# EAGLE schematic bottomtesting v6 (EAGLE 9.7.0)
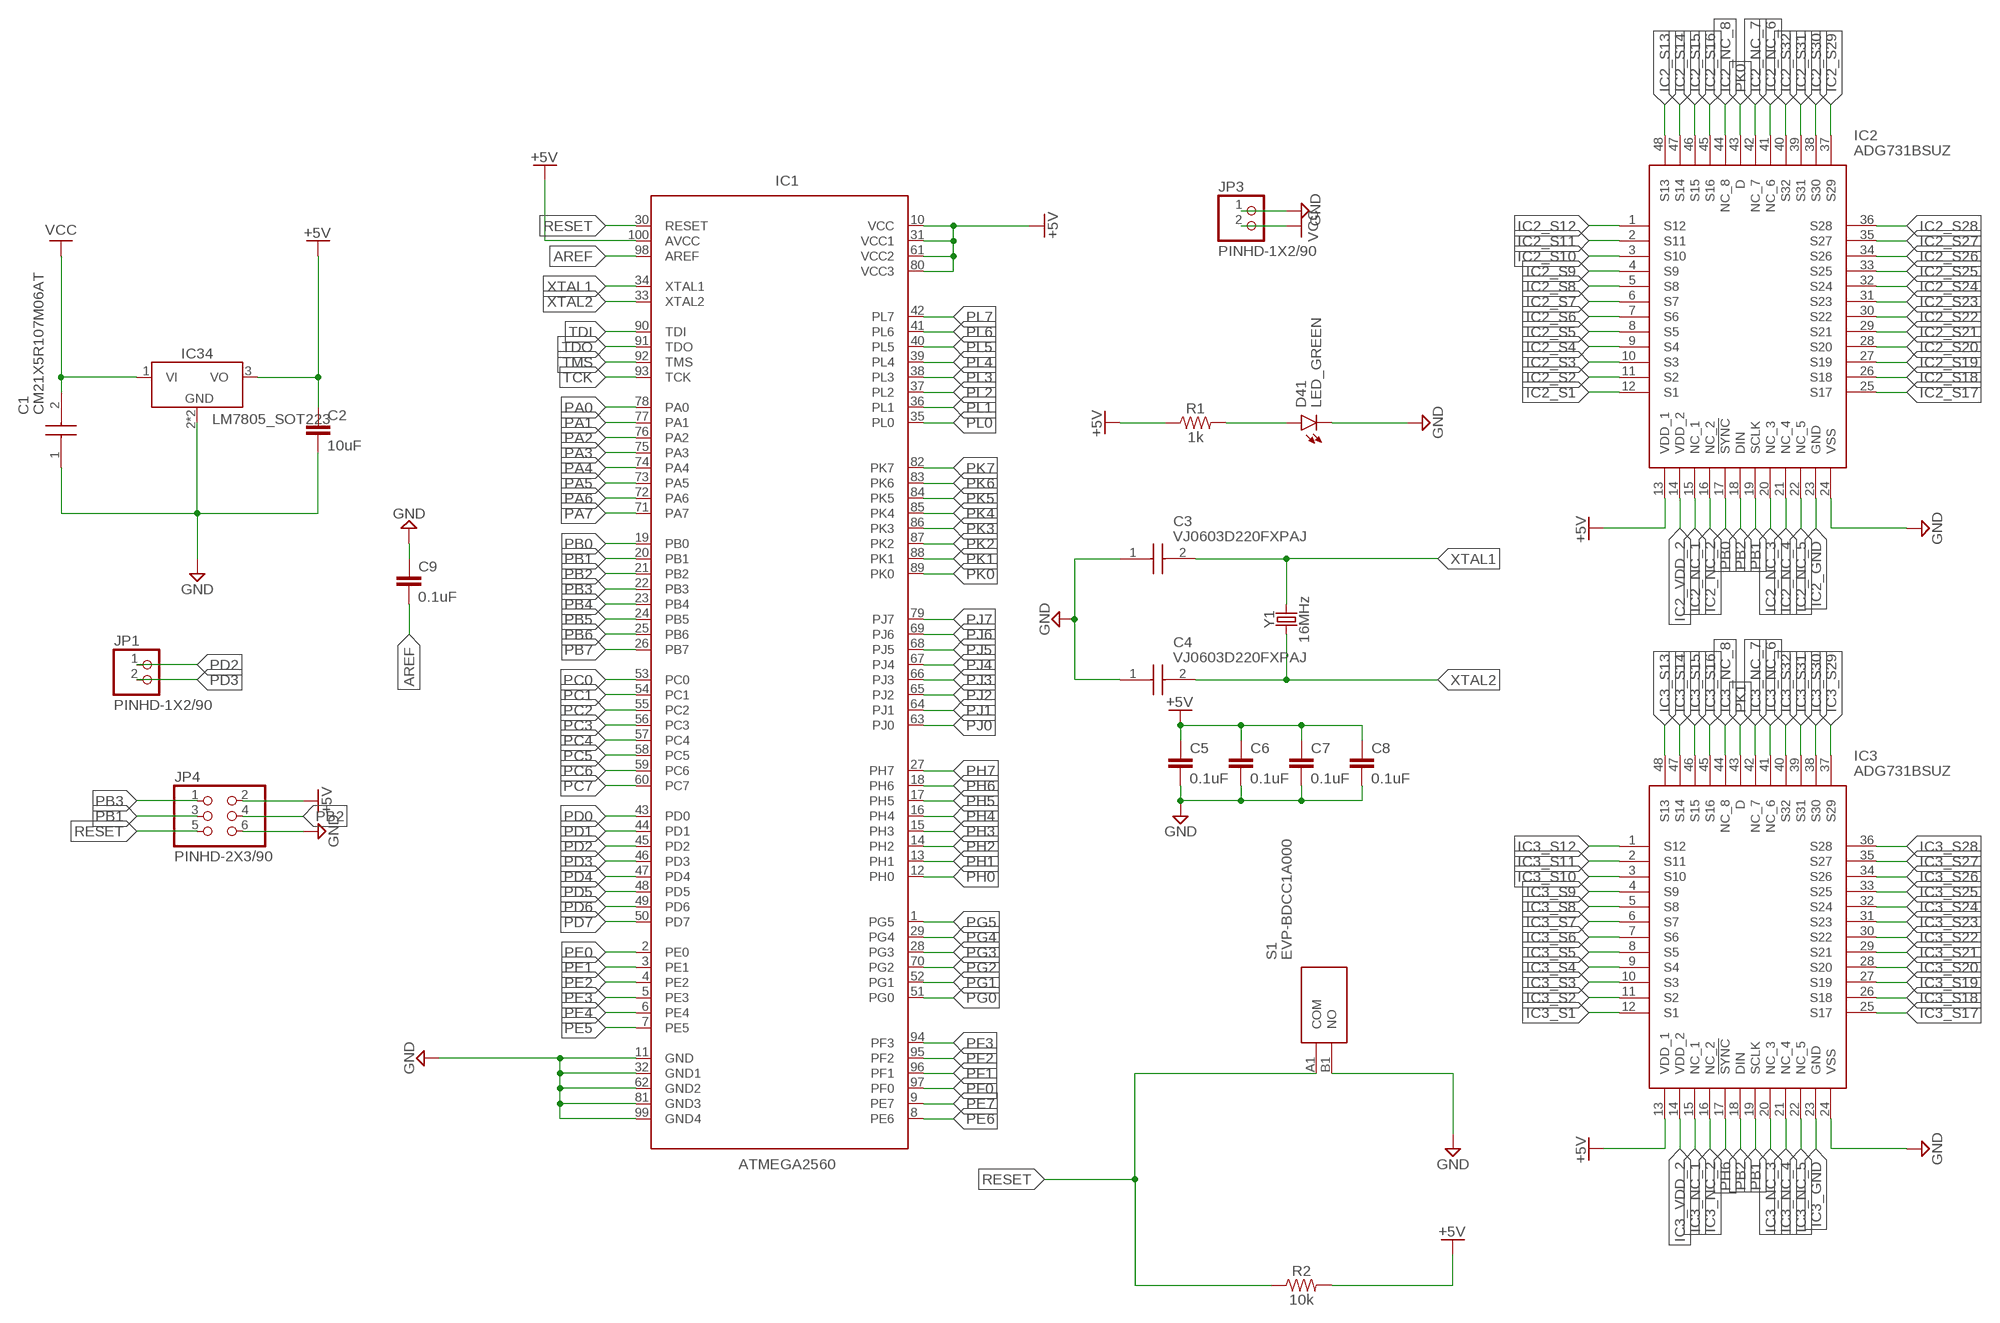
[diagram p0: schematic, sheet 1, part 1 of 2]
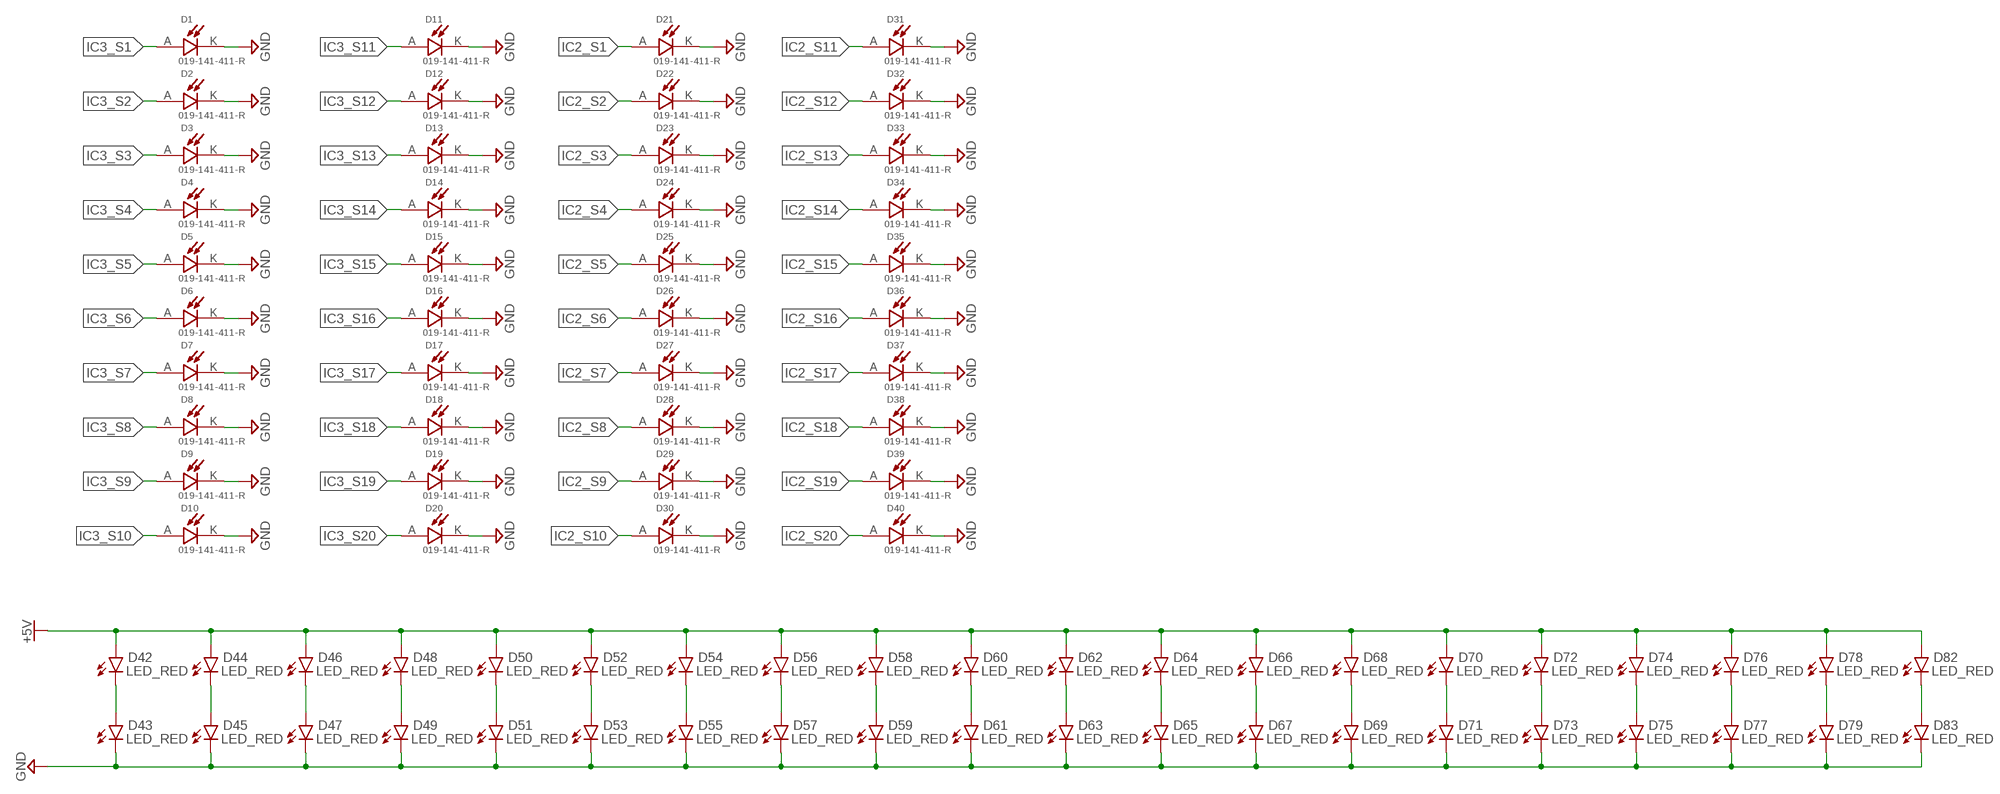
[diagram p1: schematic, sheet 1, part 2 of 2]

## Parts
C1  CM21X5R107M06AT  [CAPC2012X135N]
C2  10uF  10UF-0805-25V-10%  [0805]
C3  VJ0603D220FXPAJ  [CAPC1608X94N]
C4  VJ0603D220FXPAJ  [CAPC1608X94N]
C5  0.1uF  0.1UF-0402T-16V-10%  [0402-TIGHT]
C6  0.1uF  0.1UF-0402T-16V-10%  [0402-TIGHT]
C7  0.1uF  0.1UF-0402T-16V-10%  [0402-TIGHT]
C8  0.1uF  0.1UF-0402T-16V-10%  [0402-TIGHT]
C9  0.1uF  0.1UF-0402T-16V-10%  [0402-TIGHT]
D1  019-141-411-R  [DIOC2012X80N]
D2  019-141-411-R  [DIOC2012X80N]
D3  019-141-411-R  [DIOC2012X80N]
D4  019-141-411-R  [DIOC2012X80N]
D5  019-141-411-R  [DIOC2012X80N]
D6  019-141-411-R  [DIOC2012X80N]
D7  019-141-411-R  [DIOC2012X80N]
D8  019-141-411-R  [DIOC2012X80N]
D9  019-141-411-R  [DIOC2012X80N]
D10  019-141-411-R  [DIOC2012X80N]
D11  019-141-411-R  [DIOC2012X80N]
D12  019-141-411-R  [DIOC2012X80N]
D13  019-141-411-R  [DIOC2012X80N]
D14  019-141-411-R  [DIOC2012X80N]
D15  019-141-411-R  [DIOC2012X80N]
D16  019-141-411-R  [DIOC2012X80N]
D17  019-141-411-R  [DIOC2012X80N]
D18  019-141-411-R  [DIOC2012X80N]
D19  019-141-411-R  [DIOC2012X80N]
D20  019-141-411-R  [DIOC2012X80N]
D21  019-141-411-R  [DIOC2012X80N]
D22  019-141-411-R  [DIOC2012X80N]
D23  019-141-411-R  [DIOC2012X80N]
D24  019-141-411-R  [DIOC2012X80N]
D25  019-141-411-R  [DIOC2012X80N]
D26  019-141-411-R  [DIOC2012X80N]
D27  019-141-411-R  [DIOC2012X80N]
D28  019-141-411-R  [DIOC2012X80N]
D29  019-141-411-R  [DIOC2012X80N]
D30  019-141-411-R  [DIOC2012X80N]
D31  019-141-411-R  [DIOC2012X80N]
D32  019-141-411-R  [DIOC2012X80N]
D33  019-141-411-R  [DIOC2012X80N]
D34  019-141-411-R  [DIOC2012X80N]
D35  019-141-411-R  [DIOC2012X80N]
D36  019-141-411-R  [DIOC2012X80N]
D37  019-141-411-R  [DIOC2012X80N]
D38  019-141-411-R  [DIOC2012X80N]
D39  019-141-411-R  [DIOC2012X80N]
D40  019-141-411-R  [DIOC2012X80N]
D41  LED_GREEN  CHIP-FLAT-G_0402  [LEDC1005X25N_FLAT-G]
D42  LED_RED  LED_CHIPRED-3216  [LEDC3216X110N_R]
D43  LED_RED  LED_CHIPRED-3216  [LEDC3216X110N_R]
D44  LED_RED  LED_CHIPRED-3216  [LEDC3216X110N_R]
D45  LED_RED  LED_CHIPRED-3216  [LEDC3216X110N_R]
D46  LED_RED  LED_CHIPRED-3216  [LEDC3216X110N_R]
D47  LED_RED  LED_CHIPRED-3216  [LEDC3216X110N_R]
D48  LED_RED  LED_CHIPRED-3216  [LEDC3216X110N_R]
D49  LED_RED  LED_CHIPRED-3216  [LEDC3216X110N_R]
D50  LED_RED  LED_CHIPRED-3216  [LEDC3216X110N_R]
D51  LED_RED  LED_CHIPRED-3216  [LEDC3216X110N_R]
D52  LED_RED  LED_CHIPRED-3216  [LEDC3216X110N_R]
D53  LED_RED  LED_CHIPRED-3216  [LEDC3216X110N_R]
D54  LED_RED  LED_CHIPRED-3216  [LEDC3216X110N_R]
D55  LED_RED  LED_CHIPRED-3216  [LEDC3216X110N_R]
D56  LED_RED  LED_CHIPRED-3216  [LEDC3216X110N_R]
D57  LED_RED  LED_CHIPRED-3216  [LEDC3216X110N_R]
D58  LED_RED  LED_CHIPRED-3216  [LEDC3216X110N_R]
D59  LED_RED  LED_CHIPRED-3216  [LEDC3216X110N_R]
D60  LED_RED  LED_CHIPRED-3216  [LEDC3216X110N_R]
D61  LED_RED  LED_CHIPRED-3216  [LEDC3216X110N_R]
D62  LED_RED  LED_CHIPRED-3216  [LEDC3216X110N_R]
D63  LED_RED  LED_CHIPRED-3216  [LEDC3216X110N_R]
D64  LED_RED  LED_CHIPRED-3216  [LEDC3216X110N_R]
D65  LED_RED  LED_CHIPRED-3216  [LEDC3216X110N_R]
D66  LED_RED  LED_CHIPRED-3216  [LEDC3216X110N_R]
D67  LED_RED  LED_CHIPRED-3216  [LEDC3216X110N_R]
D68  LED_RED  LED_CHIPRED-3216  [LEDC3216X110N_R]
D69  LED_RED  LED_CHIPRED-3216  [LEDC3216X110N_R]
D70  LED_RED  LED_CHIPRED-3216  [LEDC3216X110N_R]
D71  LED_RED  LED_CHIPRED-3216  [LEDC3216X110N_R]
D72  LED_RED  LED_CHIPRED-3216  [LEDC3216X110N_R]
D73  LED_RED  LED_CHIPRED-3216  [LEDC3216X110N_R]
D74  LED_RED  LED_CHIPRED-3216  [LEDC3216X110N_R]
D75  LED_RED  LED_CHIPRED-3216  [LEDC3216X110N_R]
D76  LED_RED  LED_CHIPRED-3216  [LEDC3216X110N_R]
D77  LED_RED  LED_CHIPRED-3216  [LEDC3216X110N_R]
D78  LED_RED  LED_CHIPRED-3216  [LEDC3216X110N_R]
D79  LED_RED  LED_CHIPRED-3216  [LEDC3216X110N_R]
D82  LED_RED  LED_CHIPRED-3216  [LEDC3216X110N_R]
D83  LED_RED  LED_CHIPRED-3216  [LEDC3216X110N_R]
IC1  ATMEGA2560  ATMEGA2560-16AUR_QFP  [QFP50P1600X1600X160-100N]
IC2  ADG731BSUZ  [QFP50P900X900X120-48N]
IC3  ADG731BSUZ  [QFP50P900X900X120-48N]
IC34  LM7805_SOT223  [SOT230P700X170-4]
JP1  PINHD-1X2/90  [1X02/90]
JP3  PINHD-1X2/90  [1X02/90]
JP4  PINHD-2X3/90  [2X03/90]
R1  1k  1KOHM-0603-1/10W-1%  [0603]
R2  10k  10KOHM-0603-1/10W-1%  [0603]
S1  EVP-BDCC1A000  [EVPBDCC1A000]
Y1  16MHz  CRYSTAL-16MHZPTH-HC49US  [HC49US]

## Nets
+5V: C2.1 C5.1 C6.1 C7.1 C8.1 D42.2(A) D44.2(A) D46.2(A) D48.2(A) D50.2(A) D52.2(A) D54.2(A) D56.2(A) D58.2(A) D60.2(A) D62.2(A) D64.2(A) D66.2(A) D68.2(A) D70.2(A) D72.2(A) D74.2(A) D76.2(A) D78.2(A) D82.2(A) IC1.10(VCC) IC1.31(VCC1) IC1.61(VCC2) IC1.80(VCC3) IC1.100(AVCC) IC2.13(VDD_1) IC3.13(VDD_1) IC34.3(VO) JP4.2 R1.1 R2.2
AREF: C9.2 IC1.98(AREF)
GND: C1.1 C2.2 C5.2 C6.2 C7.2 C8.2 C9.1 D1.K(C) D2.K(C) D3.K(C) D4.K(C) D5.K(C) D6.K(C) D7.K(C) D8.K(C) D9.K(C) D10.K(C) D11.K(C) D12.K(C) D13.K(C) D14.K(C) D15.K(C) D16.K(C) D17.K(C) D18.K(C) D19.K(C) D20.K(C) D21.K(C) D22.K(C) D23.K(C) D24.K(C) D25.K(C) D26.K(C) D27.K(C) D28.K(C) D29.K(C) D30.K(C) D31.K(C) D32.K(C) D33.K(C) D34.K(C) D35.K(C) D36.K(C) D37.K(C) D38.K(C) D39.K(C) D40.K(C) D41.C D43.1(C) D45.1(C) D47.1(C) D49.1(C) D51.1(C) D53.1(C) D55.1(C) D57.1(C) D59.1(C) D61.1(C) D63.1(C) D65.1(C) D67.1(C) D69.1(C) D71.1(C) D73.1(C) D75.1(C) D77.1(C) D79.1(C) D83.1(C) IC1.11(GND) IC1.32(GND1) IC1.62(GND2) IC1.81(GND3) IC1.99(GND4) IC2.24(VSS) IC3.24(VSS) IC34.2(GND) IC34.4(GND) JP3.1 JP4.6 S1.B1(NO)
IC2_GND: IC2.23(GND)
IC2_NC_1: IC2.15(NC_1)
IC2_NC_2: IC2.16(NC_2)
IC2_NC_3: IC2.20(NC_3)
IC2_NC_4: IC2.21(NC_4)
IC2_NC_5: IC2.22(NC_5)
IC2_NC_6: IC2.41(NC_6)
IC2_NC_7: IC2.42(NC_7)
IC2_NC_8: IC2.44(NC_8)
IC2_S1: D21.A IC2.12(S1)
IC2_S2: D22.A IC2.11(S2)
IC2_S3: D23.A IC2.10(S3)
IC2_S4: D24.A IC2.9(S4)
IC2_S5: D25.A IC2.8(S5)
IC2_S6: D26.A IC2.7(S6)
IC2_S7: D27.A IC2.6(S7)
IC2_S8: D28.A IC2.5(S8)
IC2_S9: D29.A IC2.4(S9)
IC2_S10: D30.A IC2.3(S10)
IC2_S11: D31.A IC2.2(S11)
IC2_S12: D32.A IC2.1(S12)
IC2_S13: D33.A IC2.48(S13)
IC2_S14: D34.A IC2.47(S14)
IC2_S15: D35.A IC2.46(S15)
IC2_S16: D36.A IC2.45(S16)
IC2_S17: D37.A IC2.25(S17)
IC2_S18: D38.A IC2.26(S18)
IC2_S19: D39.A IC2.27(S19)
IC2_S20: D40.A IC2.28(S20)
IC2_S21: IC2.29(S21)
IC2_S22: IC2.30(S22)
IC2_S23: IC2.31(S23)
IC2_S24: IC2.32(S24)
IC2_S25: IC2.33(S25)
IC2_S26: IC2.34(S26)
IC2_S27: IC2.35(S27)
IC2_S28: IC2.36(S28)
IC2_S29: IC2.37(S29)
IC2_S30: IC2.38(S30)
IC2_S31: IC2.39(S31)
IC2_S32: IC2.40(S32)
IC2_VDD_2: IC2.14(VDD_2)
IC3_GND: IC3.23(GND)
IC3_NC_1: IC3.15(NC_1)
IC3_NC_2: IC3.16(NC_2)
IC3_NC_3: IC3.20(NC_3)
IC3_NC_4: IC3.21(NC_4)
IC3_NC_5: IC3.22(NC_5)
IC3_NC_6: IC3.41(NC_6)
IC3_NC_7: IC3.42(NC_7)
IC3_NC_8: IC3.44(NC_8)
IC3_S1: D1.A IC3.12(S1)
IC3_S2: D2.A IC3.11(S2)
IC3_S3: D3.A IC3.10(S3)
IC3_S4: D4.A IC3.9(S4)
IC3_S5: D5.A IC3.8(S5)
IC3_S6: D6.A IC3.7(S6)
IC3_S7: D7.A IC3.6(S7)
IC3_S8: D8.A IC3.5(S8)
IC3_S9: D9.A IC3.4(S9)
IC3_S10: D10.A IC3.3(S10)
IC3_S11: D11.A IC3.2(S11)
IC3_S12: D12.A IC3.1(S12)
IC3_S13: D13.A IC3.48(S13)
IC3_S14: D14.A IC3.47(S14)
IC3_S15: D15.A IC3.46(S15)
IC3_S16: D16.A IC3.45(S16)
IC3_S17: D17.A IC3.25(S17)
IC3_S18: D18.A IC3.26(S18)
IC3_S19: D19.A IC3.27(S19)
IC3_S20: D20.A IC3.28(S20)
IC3_S21: IC3.29(S21)
IC3_S22: IC3.30(S22)
IC3_S23: IC3.31(S23)
IC3_S24: IC3.32(S24)
IC3_S25: IC3.33(S25)
IC3_S26: IC3.34(S26)
IC3_S27: IC3.35(S27)
IC3_S28: IC3.36(S28)
IC3_S29: IC3.37(S29)
IC3_S30: IC3.38(S30)
IC3_S31: IC3.39(S31)
IC3_S32: IC3.40(S32)
IC3_VDD_2: IC3.14(VDD_2)
N$1: D42.1(C) D43.2(A)
N$3: D44.1(C) D45.2(A)
N$6: D46.1(C) D47.2(A)
N$9: D48.1(C) D49.2(A)
N$12: D50.1(C) D51.2(A)
N$15: D52.1(C) D53.2(A)
N$18: D54.1(C) D55.2(A)
N$21: D56.1(C) D57.2(A)
N$24: D58.1(C) D59.2(A)
N$27: D60.1(C) D61.2(A)
N$30: D62.1(C) D63.2(A)
N$33: D41.A R1.2
N$34: D64.1(C) D65.2(A)
N$37: D66.1(C) D67.2(A)
N$38: C4.2 Y1.1
N$41: D68.1(C) D69.2(A)
N$44: D70.1(C) D71.2(A)
N$47: D72.1(C) D73.2(A)
N$50: D74.1(C) D75.2(A)
N$53: D76.1(C) D77.2(A)
N$56: D78.1(C) D79.2(A)
N$62: D82.1(C) D83.2(A)
PA0: IC1.78(PA0)
PA1: IC1.77(PA1)
PA2: IC1.76(PA2)
PA3: IC1.75(PA3)
PA4: IC1.74(PA4)
PA5: IC1.73(PA5)
PA6: IC1.72(PA6)
PA7: IC1.71(PA7)
PB0: IC1.19(PB0) IC2.17(!SYNC)
PB1: IC1.20(PB1) IC2.19(SCLK) IC3.19(SCLK) JP4.3
PB2: IC1.21(PB2) IC2.18(DIN) IC3.18(DIN) JP4.4
PB3: IC1.22(PB3) JP4.1
PB4: IC1.23(PB4)
PB5: IC1.24(PB5)
PB6: IC1.25(PB6)
PB7: IC1.26(PB7)
PC0: IC1.53(PC0)
PC1: IC1.54(PC1)
PC2: IC1.55(PC2)
PC3: IC1.56(PC3)
PC4: IC1.57(PC4)
PC5: IC1.58(PC5)
PC6: IC1.59(PC6)
PC7: IC1.60(PC7)
PD0: IC1.43(PD0)
PD1: IC1.44(PD1)
PD2: IC1.45(PD2) JP1.1
PD3: IC1.46(PD3) JP1.2
PD4: IC1.47(PD4)
PD5: IC1.48(PD5)
PD6: IC1.49(PD6)
PD7: IC1.50(PD7)
PE0: IC1.2(PE0)
PE1: IC1.3(PE1)
PE2: IC1.4(PE2)
PE3: IC1.5(PE3)
PE4: IC1.6(PE4)
PE5: IC1.7(PE5)
PE6: IC1.8(PE6)
PE7: IC1.9(PE7)
PF0: IC1.97(PF0)
PF1: IC1.96(PF1)
PF2: IC1.95(PF2)
PF3: IC1.94(PF3)
PG0: IC1.51(PG0)
PG1: IC1.52(PG1)
PG2: IC1.70(PG2)
PG3: IC1.28(PG3)
PG4: IC1.29(PG4)
PG5: IC1.1(PG5)
PH0: IC1.12(PH0)
PH1: IC1.13(PH1)
PH2: IC1.14(PH2)
PH3: IC1.15(PH3)
PH4: IC1.16(PH4)
PH5: IC1.17(PH5)
PH6: IC1.18(PH6) IC3.17(!SYNC)
PH7: IC1.27(PH7)
PJ0: IC1.63(PJ0)
PJ1: IC1.64(PJ1)
PJ2: IC1.65(PJ2)
PJ3: IC1.66(PJ3)
PJ4: IC1.67(PJ4)
PJ5: IC1.68(PJ5)
PJ6: IC1.69(PJ6)
PJ7: IC1.79(PJ7)
PK0: IC1.89(PK0) IC2.43(D)
PK1: IC1.88(PK1) IC3.43(D)
PK2: IC1.87(PK2)
PK3: IC1.86(PK3)
PK4: IC1.85(PK4)
PK5: IC1.84(PK5)
PK6: IC1.83(PK6)
PK7: IC1.82(PK7)
PL0: IC1.35(PL0)
PL1: IC1.36(PL1)
PL2: IC1.37(PL2)
PL3: IC1.38(PL3)
PL4: IC1.39(PL4)
PL5: IC1.40(PL5)
PL6: IC1.41(PL6)
PL7: IC1.42(PL7)
RESET: IC1.30(RESET) JP4.5 R2.1 S1.A1(COM)
TCK: IC1.93(TCK)
TDI: IC1.90(TDI)
TDO: IC1.91(TDO)
TMS: IC1.92(TMS)
VCC: C1.2 IC34.1(VI) JP3.2
XTAL1: C3.2 IC1.34(XTAL1) Y1.2
XTAL2: C3.1 C4.1 IC1.33(XTAL2) ; supply symbol labelled GND

## Library data of the parts
C1 = CM21X5R107M06AT:CM21X5R107M06AT: Multilayer Ceramic Capacitors MLCC - SMD/SMT 6.3V 100uF X5R 0805 20% 3Term Source: Datasheet <https://www.mouser.it/ProductDetail/KYOCERA-AVX/CM21X5R107M06AT?qs=sGAEpiMZZMsh%2B1woXyUXj9Ay8exncNnhpnCEzIsfmDk=>; DESCRIPTION: Multilayer Ceramic Capacitors MLCC - SMD/SMT 6.3V 100uF X5R 0805 20% 3Term; HEIGHT: 1.35mm; MANUFACTURER_NAME: KYOCERA; MANUFACTURER_PART_NUMBER: CM21X5R107M06AT; MOUSER_PART_NUMBER: 581-CM21X5R107M06AT; MOUSER_PRICE-STOCK: https://www.mouser.co.uk/ProductDetail/KYOCERA-AVX/CM21X5R107M06AT?qs=Znm5pLBrcAI44q2aWOSJYQ%3D%3D
C2 = SparkFun-Capacitors:10UF: 10.0µF ceramic capacitors A capacitor is a passive two-terminal electrical component used to store electrical energy temporarily in an electric field.; PROD_ID: CAP-14259
C3 C4 = VJ0603D220FXPAJ:VJ0603D220FXPAJ: Multilayer Ceramic Capacitors MLCC - SMD/SMT 0603 22pF 250V C0G 1% HI FREQ Source: Datasheet <https://www.mouser.it/datasheet/2/427/vjhifreqseries-2634772.pdf>; DESCRIPTION: Multilayer Ceramic Capacitors MLCC - SMD/SMT 0603 22pF 250V C0G 1% HI FREQ; HEIGHT: 0.94mm; MANUFACTURER_NAME: Vishay; MANUFACTURER_PART_NUMBER: VJ0603D220FXPAJ; MOUSER_PART_NUMBER: 77-VJ0603D220FXPAJ; MOUSER_PRICE-STOCK: https://www.mouser.co.uk/ProductDetail/Vishay-Vitramon/VJ0603D220FXPAJ?qs=iYZfuFMDqcb%2FcnkyiAmShQ%3D%3D
C5-C9 = SparkFun-Capacitors:0.1UF: 0.1µF ceramic capacitors A capacitor is a passive two-terminal electrical component used to store electrical energy temporarily in an electric field.; PROD_ID: CAP-12416
D1-D40 = 019-141-411-R:019-141-411-R: PHOTODIODE RED MICRO SMT; MANUFACTURER: Advanced Photonix; MAXIMUM_PACKAGE_HEIGHT: 0.8mm; PARTREV: Rev 5/7/2019; STANDARD: IPC 7351B
D41 = LED:CHIP-FLAT-G; CATEGORY: LED; COLOR: GREEN; DESCRIPTION: CHIP LED FLAT; SUB-CATEGORY: CHIP; TYPE: FLAT_TOP
D42-D79 D82 D83 = Opto-Electronic:LED_CHIP: LED - Generic; CATEGORY: Opto-Electronic; COLOR: Red; SUB-CATEGORY: LED
IC1 = IC_Embedded:ATMEGA2560*: 8-bit Microcontroller with 16/32/64KB In-System Programmable Flash Datasheet <https://ww1.microchip.com/downloads/en/DeviceDoc/ATmega640-1280-1281-2560-2561-Datasheet-DS40002211A.pdf>; CATEGORY: IC_Embedded; DESCRIPTION: IC MCU 8BIT 256KB FLASH 100TQFP; MANUFACTURER: Microchip Technology; MPN: ATMEGA2560-16AUR; OPERATING_TEMP: -40°C to 85°C; PART_STATUS: Active; SERIES: AVR® ATmega; SPEED: 16MHz; SUB-CATEGORY: Microcontroller
IC2 IC3 = ADG731BSUZ:ADG731BSUZ: ADG731BSUZ, Multiplexer Single 32:1, 3, 5V, 48-Pin, TQFP Source: Datasheet <https://datasheet.datasheetarchive.com/originals/distributors/Datasheets-4/DSA-69834.pdf>; DESCRIPTION: ADG731BSUZ, Multiplexer Single 32:1, 3, 5V, 48-Pin, TQFP; HEIGHT: 1.2mm; MANUFACTURER_NAME: Analog Devices; MANUFACTURER_PART_NUMBER: ADG731BSUZ; MOUSER_PART_NUMBER: 584-ADG731BSUZ; MOUSER_PRICE-STOCK: https://www.mouser.co.uk/ProductDetail/Analog-Devices/ADG731BSUZ?qs=BpaRKvA4VqEJueulxDCy6w%3D%3D
IC34 = IC_Power-Management:LM7805: 5V Voltage Regulator Reference Datasheet <https://www.ti.com/lit/ds/symlink/lm340.pdf>; CATEGORY: IC_Logic; DESCRIPTION: 5V Voltage Regulator; MANUFACTURER: Generic; MPN: Generic; SERIES: LM7805; SUB-CATEGORY: Voltage Regulator; TYPE: 5V
JP1 JP3 = Connector:PINHD-1X2: PIN HEADER; CATEGORY: CONNECTOR; SUB-CATEGORY: PIN-HEADER
JP4 = Connector:PINHD-2X3: PIN HEADER; CATEGORY: Headers; DESCRIPTION: Header, Right Angle, 2x3 Position; MANUFACTURER: Generic; MPN: Generic; OPERATING_TEMPERATURE: Generic; PART_STATUS: Active; PITCH: 0.100" (2.54mm); ROHS_COMPLIANCE: Generic; SERIES: Generic; SUB-CATEGORY: Headers, Male Pins; TYPE: Board to Board or Cable, Unshrouded, Through Hole, Right Angle
R1 = SparkFun-Resistors:1KOHM: 1kΩ resistor A resistor is a passive two-terminal electrical component that implements electrical resistance as a circuit element. Resistors act to reduce current flow, and, at the same time, act to lower voltage levels within circuits. - Wikipedia; PROD_ID: RES-07856
R2 = SparkFun-Resistors:10KOHM: 10kΩ resistor A resistor is a passive two-terminal electrical component that implements electrical resistance as a circuit element. Resistors act to reduce current flow, and, at the same time, act to lower voltage levels within circuits. - Wikipedia; PROD_ID: RES-00824
S1 = EVP-BDCC1A000:EVP-BDCC1A000: Tactile Switches 6mm x 6mm SMD Op Force 4.0N Source: Datasheet <https://api.pim.na.industrial.panasonic.com/file_stream/main/fileversion/245483>; DESCRIPTION: Tactile Switches 6mm x 6mm SMD Op Force 4.0N; HEIGHT: 4.2mm; MANUFACTURER_NAME: Panasonic; MANUFACTURER_PART_NUMBER: EVP-BDCC1A000; MOUSER_PART_NUMBER: 667-EVP-BDCC1A000; MOUSER_PRICE-STOCK: https://www.mouser.co.uk/ProductDetail/Panasonic/EVP-BDCC1A000?qs=4qgZ1GHix0Ui2FekNThUWQ%3D%3D
Y1 = SparkFun-Clocks:CRYSTAL-16MHZ: 16MHz Crystal Digikey Example <http://www.digikey.com/product-search/en?keywords=535-9122-1-ND> Frequency: 16MHz Frequency Stability: ±50ppm Frequency Tolerance: ±20ppm Load Capacitance: 18pF SparkFun Products: Pro Micro -5V/16MHz <https://www.sparkfun.com/products/12640> SparkFun Serial Enabled LCD Kit <https://www.sparkfun.com/products/10097>; PROD_ID: XTAL-08181; SF_ID: COM-00536